# Altium schematic sheet M150.SchDoc
size A2
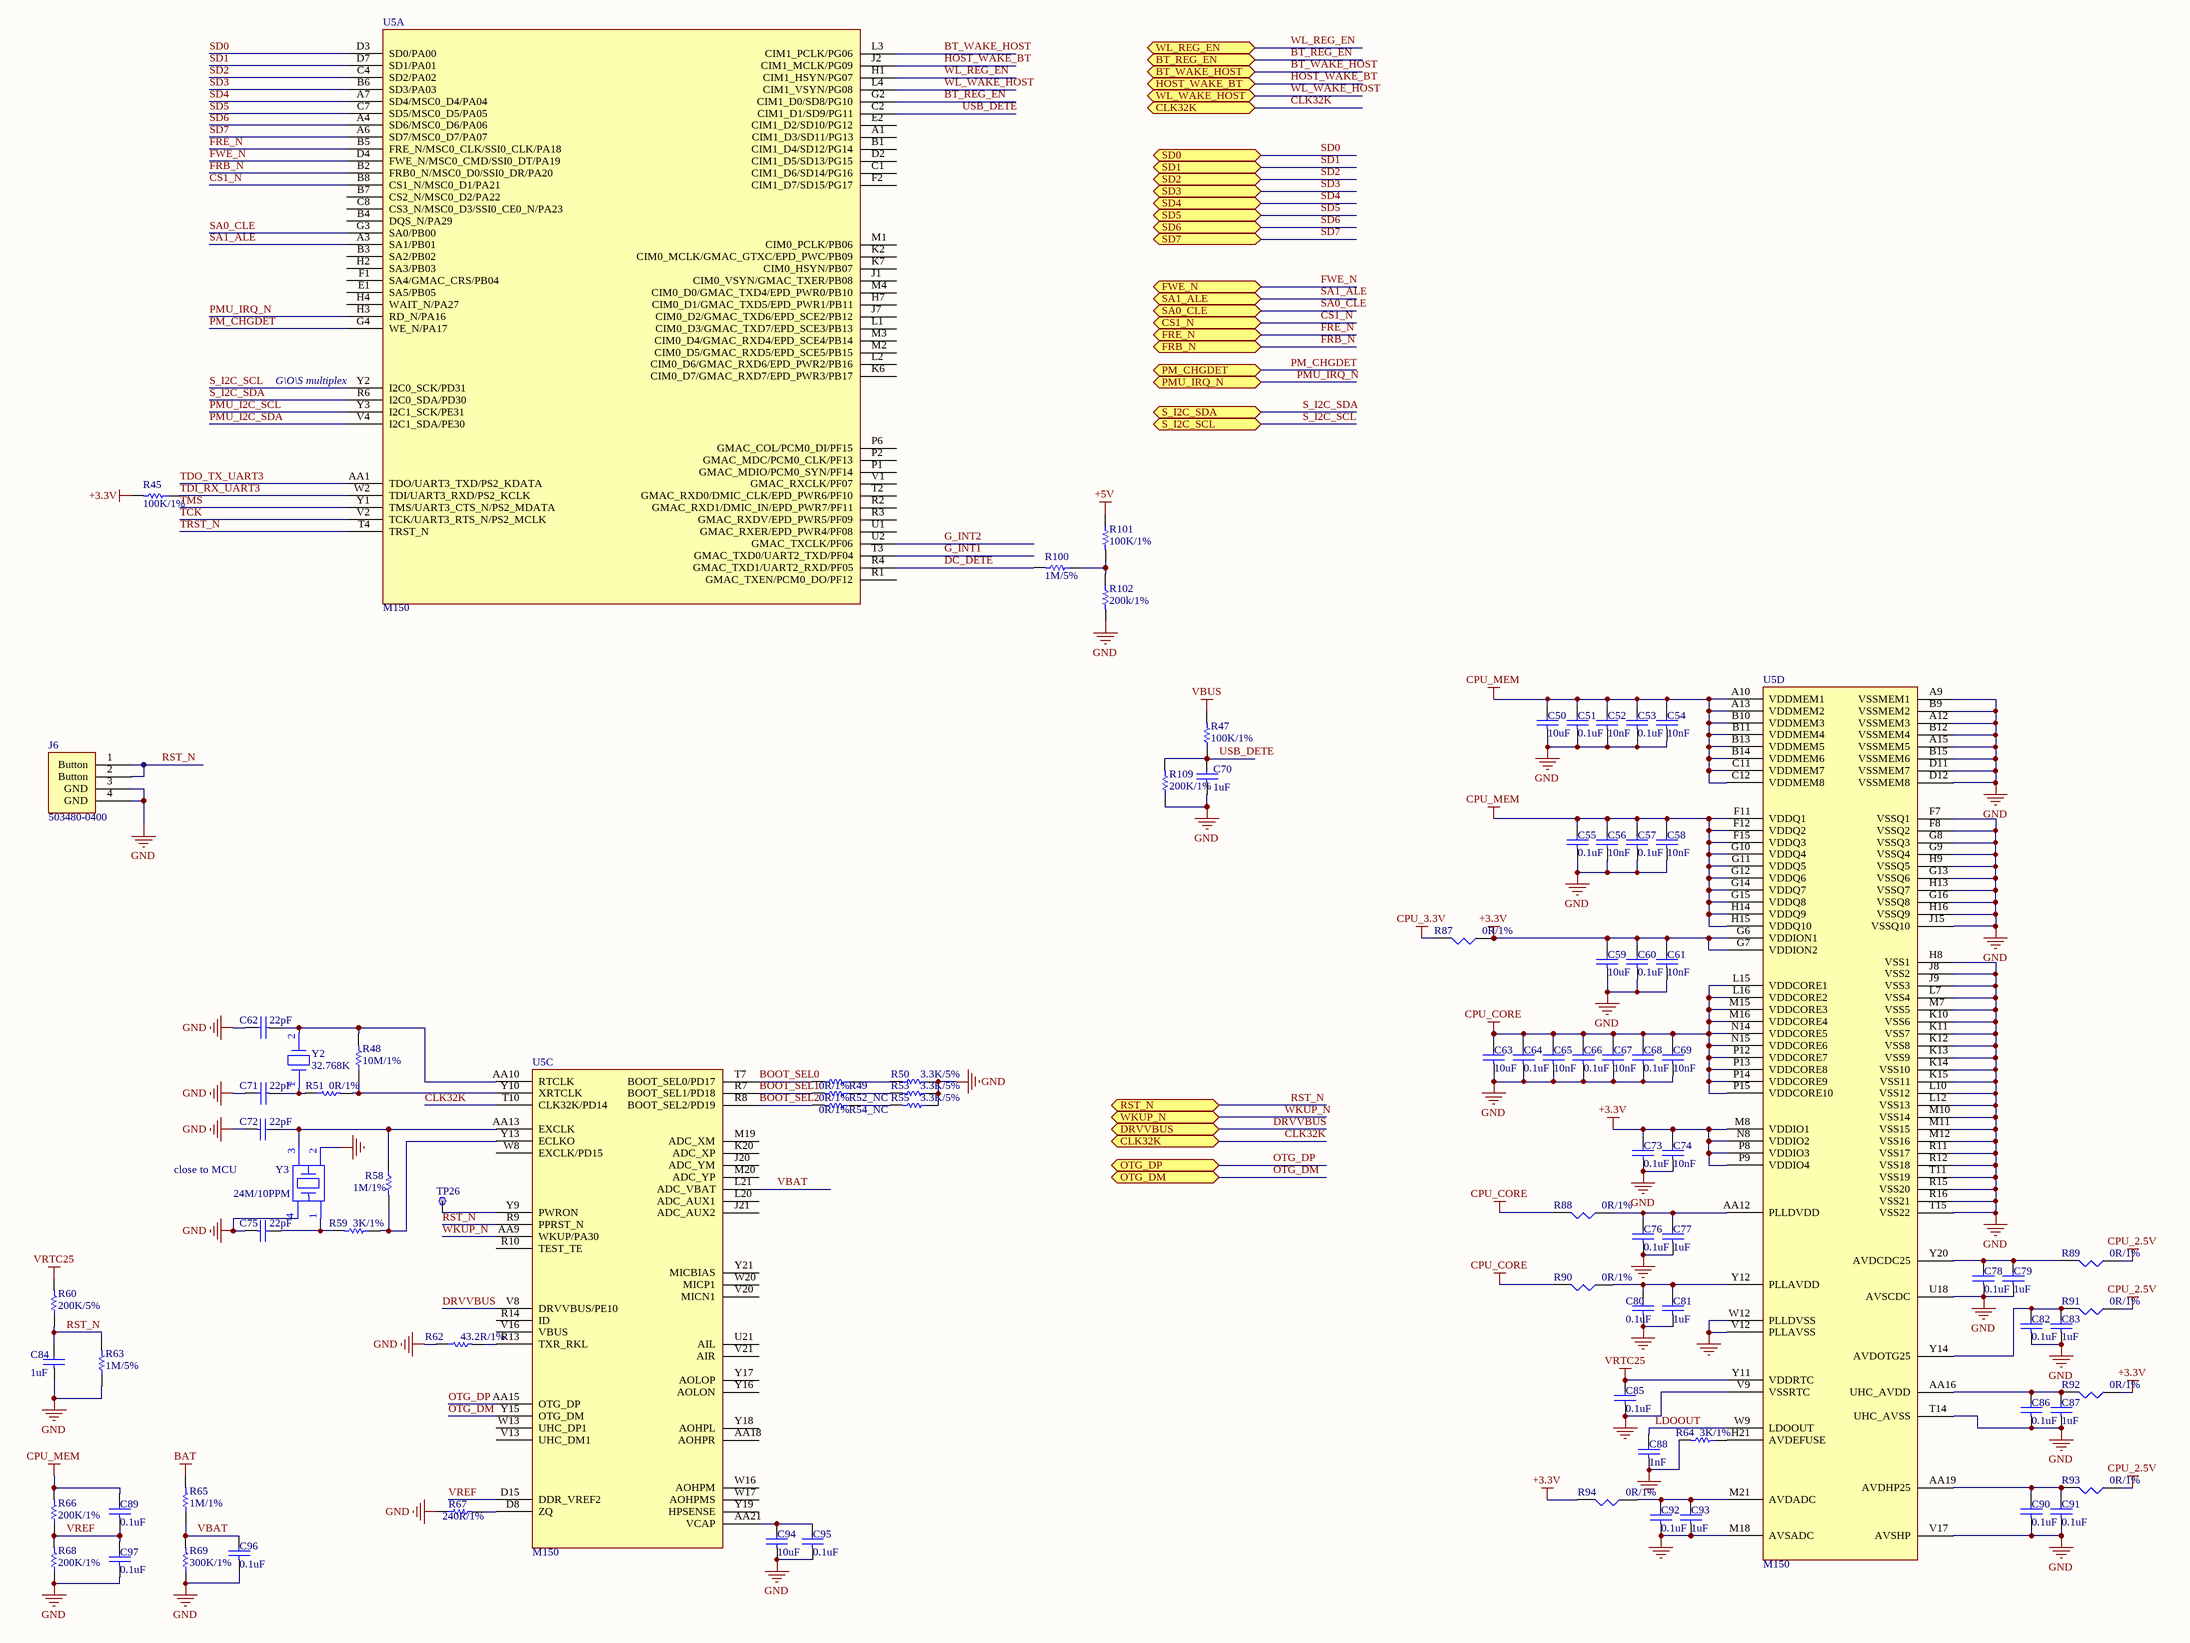
[diagram p0: M150.SchDoc]

## Parts
C50  10uF  [0402C]
C51  0.1uF  [0402C]
C52  10nF  [0402C]
C53  0.1uF  [0402C]
C54  10nF  [0402C]
C55  0.1uF  [0402C]
C56  10nF  [0402C]
C57  0.1uF  [0402C]
C58  10nF  [0402C]
C59  10uF  [0402C]
C60  0.1uF  [0402C]
C61  10nF  [0402C]
C62  22pF  [0402C]
C63  10uF  [0402C]
C64  0.1uF  [0402C]
C65  10nF  [0402C]
C66  0.1uF  [0402C]
C67  10nF  [0402C]
C68  0.1uF  [0402C]
C69  10nF  [0402C]
C70  1uF  [0402C]
C71  22pF  [0402C]
C72  22pF  [0402C]
C73  0.1uF  [0402C]
C74  10nF  [0402C]
C75  22pF  [0402C]
C76  0.1uF  [0402C]
C77  1uF  [0402C]
C78  0.1uF  [0402C]
C79  1uF  [0402C]
C80  0.1uF  [0402C]
C81  1uF  [0402C]
C82  0.1uF  [0402C]
C83  1uF  [0402C]
C84  1uF  [0402C]
C85  0.1uF  [0402C]
C86  0.1uF  [0402C]
C87  1uF  [0402C]
C88  1nF  [0402C]
C89  0.1uF  [0402C]
C90  0.1uF  [0402C]
C91  0.1uF  [0402C]
C92  0.1uF  [0402C]
C93  1uF  [0402C]
C94  10uF  [0402C]
C95  0.1uF  [0402C]
C96  0.1uF  [0402C]
C97  0.1uF  [0402C]
J6  503480-0400
R45  100K/1%  [0402R]
R47  100K/1%  [0402R]
R48  10M/1%  [0603R]
R49  0R/1%  [0603R]
R50  3.3K/5%  [0603R]
R51  0R/1%  [0603R]
R52_NC  0R/1%  [0603R]
R53  3.3K/5%  [0603R]
R54_NC  0R/1%  [0603R]
R55  3.3K/5%  [0603R]
R58  1M/1%  [0402R]
R59  3K/1%  [0402R]
R60  200K/5%  [0402R]
R62  43.2R/1%  [0402R]
R63  1M/5%  [0402R]
R64  3K/1%  [0402R]
R65  1M/1%  [0402R]
R66  200K/1%  [0402R]
R67  240R/1%  [0402R]
R68  200K/1%  [0402R]
R69  300K/1%  [0402R]
R87  0R/1%  [0603R]
R88  0R/1%  [0603R]
R89  0R/1%  [0603R]
R90  0R/1%  [0603R]
R91  0R/1%  [0603R]
R92  0R/1%  [0603R]
R93  0R/1%  [0603R]
R94  0R/1%  [0603R]
R100  1M/5%  [0402R]
R101  100K/1%  [0402R]
R102  200k/1%  [0402R]
R109  200K/1%  [0402R]
TP26  TP  [TP_C40]  (value not drawn)
U5  M150  [Model Name]  (parts A,C,D of 4)
Y2  32.768K  [XTALSMD2-3215]
Y3  24M/10PPM  [XTALSMD2-2520]

## Ports
BT_REG_EN (bidir), BT_WAKE_HOST (bidir), CLK32K (bidir), CS1_N (bidir), DRVVBUS (bidir), FRB_N (bidir), FRE_N (bidir), FWE_N (bidir), HOST_WAKE_BT (bidir), OTG_DM (bidir), OTG_DP (bidir), PM_CHGDET (bidir), PMU_IRQ_N (bidir), RST_N (bidir), S_I2C_SCL (bidir), S_I2C_SDA (bidir), SA0_CLE (bidir), SA1_ALE (bidir), SD0 (bidir), SD1 (bidir), SD2 (bidir), SD3 (bidir), SD4 (bidir), SD5 (bidir), SD6 (bidir), SD7 (bidir), WKUP_N (bidir), WL_REG_EN (bidir), WL_WAKE_HOST (bidir)

## Nets
+3.3V: C59.2 C60.2 C61.2 C73.2 C74.2 R45.2 R87.1 R92.1 R94.2 U5.G6(VDDION1) U5.G7(VDDION2) U5.M8(VDDIO1) U5.N8(VDDIO2) U5.P8(VDDIO3) U5.P9(VDDIO4)
+5V: R101.1
BAT: R65.2
CPU_2.5V: R89.1 R91.1 R93.1
CPU_3.3V: R87.2
CPU_CORE: C63.2 C64.2 C65.2 C66.2 C67.2 C68.2 C69.2 R88.2 R90.2 U5.L15(VDDCORE1) U5.L16(VDDCORE2) U5.M15(VDDCORE3) U5.M16(VDDCORE4) U5.N14(VDDCORE5) U5.N15(VDDCORE6) U5.P12(VDDCORE7) U5.P13(VDDCORE8) U5.P14(VDDCORE9) U5.P15(VDDCORE10)
CPU_MEM: C50.2 C51.2 C52.2 C53.2 C54.2 C55.2 C56.2 C57.2 C58.2 C89.2 R66.2 U5.A10(VDDMEM1) U5.A13(VDDMEM2) U5.B10(VDDMEM3) U5.B11(VDDMEM4) U5.B13(VDDMEM5) U5.B14(VDDMEM6) U5.C11(VDDMEM7) U5.C12(VDDMEM8) U5.F11(VDDQ1) U5.F12(VDDQ2) U5.F15(VDDQ3) U5.G10(VDDQ4) U5.G11(VDDQ5) U5.G12(VDDQ6) U5.G14(VDDQ7) U5.G15(VDDQ8) U5.H14(VDDQ9) U5.H15(VDDQ10)
GND: C50.1 C51.1 C52.1 C53.1 C54.1 C55.1 C56.1 C57.1 C58.1 C59.1 C60.1 C61.1 C62.2 C63.1 C64.1 C65.1 C66.1 C67.1 C68.1 C69.1 C70.1 C71.2 C72.1 C73.1 C74.1 C75.1 C76.1 C77.1 C78.1 C79.1 C80.1 C81.1 C82.1 C83.1 C84.1 C85.1 C86.1 C87.1 C88.1 C90.1 C91.1 C92.1 C93.1 C94.1 C95.1 C96.1 C97.1 J6.3(GND) J6.4(GND) R50.1 R53.1 R55.1 R62.1 R63.1 R64.2 R67.1 R68.1 R69.1 R102.2 R109.1 U5.A9(VSSMEM1) U5.A12(VSSMEM3) U5.A15(VSSMEM5) U5.B9(VSSMEM2) U5.B12(VSSMEM4) U5.B15(VSSMEM6) U5.D11(VSSMEM7) U5.D12(VSSMEM8) U5.F7(VSSQ1) U5.F8(VSSQ2) U5.G8(VSSQ3) U5.G9(VSSQ4) U5.G13(VSSQ6) U5.G16(VSSQ8) U5.H8(VSS1) U5.H9(VSSQ5) U5.H13(VSSQ7) U5.H16(VSSQ9) U5.J8(VSS2) U5.J9(VSS3) U5.J15(VSSQ10) U5.K10(VSS6) U5.K11(VSS7) U5.K12(VSS8) U5.K13(VSS9) U5.K14(VSS10) U5.K15(VSS11) U5.L7(VSS4) U5.L10(VSS12) U5.L12(VSS13) U5.M7(VSS5) U5.M10(VSS14) U5.M11(VSS15) U5.M12(VSS16) U5.M18(AVSADC) U5.R11(VSS17) U5.R12(VSS18) U5.R15(VSS20) U5.R16(VSS21) U5.T11(VSS19) U5.T14(UHC_AVSS) U5.T15(VSS22) U5.U18(AVSCDC) U5.V9(VSSRTC) U5.V12(PLLAVSS) U5.V17(AVSHP) U5.W12(PLLDVSS) Y3.2 Y3.4
VBUS: R47.2
VRTC25: C85.2 R60.2 U5.Y11(VDDRTC)
BOOT_SEL0: R49.2 U5.T7(BOOT_SEL0/PD17)
BOOT_SEL1: R52_NC.2 U5.R7(BOOT_SEL1/PD18)
BOOT_SEL2: R54_NC.2 U5.R8(BOOT_SEL2/PD19)
BT_REG_EN: U5.G2(CIM1_D0/SD8/PG10) ; port BT_REG_EN
BT_WAKE_HOST: U5.L3(CIM1_PCLK/PG06) ; port BT_WAKE_HOST
CLK32K: U5.T10(CLK32K/PD14) ; port CLK32K
CS1_N: U5.B8(CS1_N/MSC0_D1/PA21) ; port CS1_N
DC_DETE: R100.2 U5.R4(GMAC_TXD1/UART2_RXD/PF05)
DRVVBUS: U5.V8(DRVVBUS/PE10) ; port DRVVBUS
FRB_N: U5.B2(FRB0_N/MSC0_D0/SSI0_DR/PA20) ; port FRB_N
FRE_N: U5.B5(FRE_N/MSC0_CLK/SSI0_CLK/PA18) ; port FRE_N
FWE_N: U5.D4(FWE_N/MSC0_CMD/SSI0_DT/PA19) ; port FWE_N
G_INT1: U5.T3(GMAC_TXD0/UART2_TXD/PF04)
G_INT2: U5.U2(GMAC_TXCLK/PF06)
HOST_WAKE_BT: U5.J2(CIM1_MCLK/PG09) ; port HOST_WAKE_BT
LDOOUT: C88.2 U5.W9(LDOOUT)
OTG_DM: U5.Y15(OTG_DM) ; port OTG_DM
OTG_DP: U5.AA15(OTG_DP) ; port OTG_DP
PM_CHGDET: U5.G4(WE_N/PA17) ; port PM_CHGDET
PMU_I2C_SCL: U5.Y3(I2C1_SCK/PE31)
PMU_I2C_SDA: U5.V4(I2C1_SDA/PE30)
PMU_IRQ_N: U5.H3(RD_N/PA16) ; port PMU_IRQ_N
RST_N: C84.2 J6.1(Button) J6.2(Button) R60.1 R63.2 U5.R9(PPRST_N) ; port RST_N
S_I2C_SCL: U5.Y2(I2C0_SCK/PD31) ; port S_I2C_SCL
S_I2C_SDA: U5.R6(I2C0_SDA/PD30) ; port S_I2C_SDA
SA0_CLE: U5.G3(SA0/PB00) ; port SA0_CLE
SA1_ALE: U5.A3(SA1/PB01) ; port SA1_ALE
SD0: U5.D3(SD0/PA00) ; port SD0
SD1: U5.D7(SD1/PA01) ; port SD1
SD2: U5.C4(SD2/PA02) ; port SD2
SD3: U5.B6(SD3/PA03) ; port SD3
SD4: U5.A7(SD4/MSC0_D4/PA04) ; port SD4
SD5: U5.C7(SD5/MSC0_D5/PA05) ; port SD5
SD6: U5.A4(SD6/MSC0_D6/PA06) ; port SD6
SD7: U5.A6(SD7/MSC0_D7/PA07) ; port SD7
TCK: U5.V2(TCK/UART3_RTS_N/PS2_MCLK)
TDI_RX_UART3: R45.1 U5.W2(TDI/UART3_RXD/PS2_KCLK)
TDO_TX_UART3: U5.AA1(TDO/UART3_TXD/PS2_KDATA)
TMS: U5.Y1(TMS/UART3_CTS_N/PS2_MDATA)
TRST_N: U5.T4(TRST_N)
USB_DETE: C70.2 R47.1 R109.2 U5.C2(CIM1_D1/SD9/PG11)
VBAT: C96.2 R65.1 R69.2 U5.L21(ADC_VBAT)
VREF: C89.1 C97.2 R66.1 R68.2 U5.D15(DDR_VREF2)
WKUP_N: U5.AA9(WKUP/PA30) ; port WKUP_N
WL_REG_EN: U5.H1(CIM1_HSYN/PG07) ; port WL_REG_EN
WL_WAKE_HOST: U5.L4(CIM1_VSYN/PG08) ; port WL_WAKE_HOST
NetC62_1: C62.1 R48.2 U5.AA10(RTCLK) Y2.2
NetC71_1: C71.1 R51.1 Y2.1
NetC72_2: C72.2 R58.1 U5.AA13(EXCLK) Y3.3
NetC75_2: C75.2 R59.2 Y3.1
NetC76_2: C76.2 C77.2 R88.1 U5.AA12(PLLDVDD)
NetC78_2: C78.2 C79.2 R89.2 U5.Y20(AVDCDC25)
NetC80_2: C80.2 C81.2 R90.1 U5.Y12(PLLAVDD)
NetC82_2: C82.2 C83.2 R91.2 U5.Y14(AVDOTG25)
NetC86_2: C86.2 C87.2 R92.2 U5.AA16(UHC_AVDD)
NetC90_2: C90.2 C91.2 R93.2 U5.AA19(AVDHP25)
NetC92_2: C92.2 C93.2 R94.1 U5.M21(AVDADC)
NetC94_2: C94.2 C95.2 U5.AA21(VCAP)
NetR48_1: R48.1 R51.2 U5.Y10(XRTCLK)
NetR49_1: R49.1 R50.2
NetR52_NC_1: R52_NC.1 R53.2
NetR54_NC_1: R54_NC.1 R55.2
NetR58_2: R58.2 R59.1 U5.Y13(ECLKO)
NetR62_2: R62.2 U5.R13(TXR_RKL)
NetR64_1: R64.1 U5.H21(AVDEFUSE)
NetR67_2: R67.2 U5.D8(ZQ)
NetR100_1: R100.1 R101.2 R102.1
NetTP26_1: TP26.1 U5.Y9(PWRON)

Not connected (* = marked no-connect by the designer): U5 A1(CIM1_D3/SD11/PG13) AA18(AOHPR) B1(CIM1_D4/SD12/PG14) B3(SA2/PB02) B4(DQS_N/PA29) B7(CS2_N/MSC0_D2/PA22) C1(CIM1_D6/SD14/PG16) C8(CS3_N/MSC0_D3/SSI0_CE0_N/PA23) D2(CIM1_D5/SD13/PG15) E1(SA5/PB05) E2(CIM1_D2/SD10/PG12) F1(SA4/GMAC_CRS/PB04) F2(CIM1_D7/SD15/PG17) H2(SA3/PB03) H4(WAIT_N/PA27) H7(CIM0_D1/GMAC_TXD5/EPD_PWR1/PB11) J1(CIM0_VSYN/GMAC_TXER/PB08) J7(CIM0_D2/GMAC_TXD6/EPD_SCE2/PB12) J20(ADC_YM) J21(ADC_AUX2) K2(CIM0_MCLK/GMAC_GTXC/EPD_PWC/PB09) K6(CIM0_D7/GMAC_RXD7/EPD_PWR3/PB17) K7(CIM0_HSYN/PB07) K20(ADC_XP) L1(CIM0_D3/GMAC_TXD7/EPD_SCE3/PB13) L2(CIM0_D6/GMAC_RXD6/EPD_PWR2/PB16) L20(ADC_AUX1) M1(CIM0_PCLK/PB06) M2(CIM0_D5/GMAC_RXD5/EPD_SCE5/PB15) M3(CIM0_D4/GMAC_RXD4/EPD_SCE4/PB14) M4(CIM0_D0/GMAC_TXD4/EPD_PWR0/PB10) M19(ADC_XM) M20(ADC_YP) P1(GMAC_MDIO/PCM0_SYN/PF14) P2(GMAC_MDC/PCM0_CLK/PF13) P6(GMAC_COL/PCM0_DI/PF15) R1(GMAC_TXEN/PCM0_DO/PF12) R2(GMAC_RXD1/DMIC_IN/EPD_PWR7/PF11) R3(GMAC_RXDV/EPD_PWR5/PF09) R10(TEST_TE) R14(ID) T2(GMAC_RXD0/DMIC_CLK/EPD_PWR6/PF10) U1(GMAC_RXER/EPD_PWR4/PF08) U21(AIL) V1(GMAC_RXCLK/PF07) V13(UHC_DM1) V16(VBUS) V20(MICN1) V21(AIR) W8(EXCLK/PD15) W13(UHC_DP1) W16(AOHPM) W17(AOHPMS) W20(MICP1) Y16(AOLON) Y17(AOLOP) Y18(AOHPL) Y19(HPSENSE) Y21(MICBIAS)

## Notes on the sheet
- (near U5) G\O\S multiplex
- close to MCU

## Library data of the parts
C50-C61 C63-C70 C72-C97 = CAP: 厂家：Murata，型号：GRM1555C1H120JA01D
C62 C71 = CAP: Capacitor; Ordered by: Subcon
J6 = 50348: 厂家：Molex，型号：503480-0400
R45 R47-R51 R52_NC R53 R54_NC R55 R58-R60 R62-R69 R100-R102 R109 = Res1: Resistor; Value: 1K; Ordered by: Subcon; Published: 8-Jun-2000; Revision: July-2002: Re-released for DXP Platform.; Publisher: Altium Limited
R87-R94 = RES1: 厂家：Yageo，型号：RC0402FR-070RL
TP26 = TP: Ordered by: Subcon
Y2 = CRYSTAL3: 厂家：EPSON，型号：Q13FC1350000400
Y3 = CR: 厂家：EPSON，型号：Q24FA20H0004400